# Altium schematic sheet Flash.SchDoc
size A4; SheetNumber: 8; SheetTotal: 8
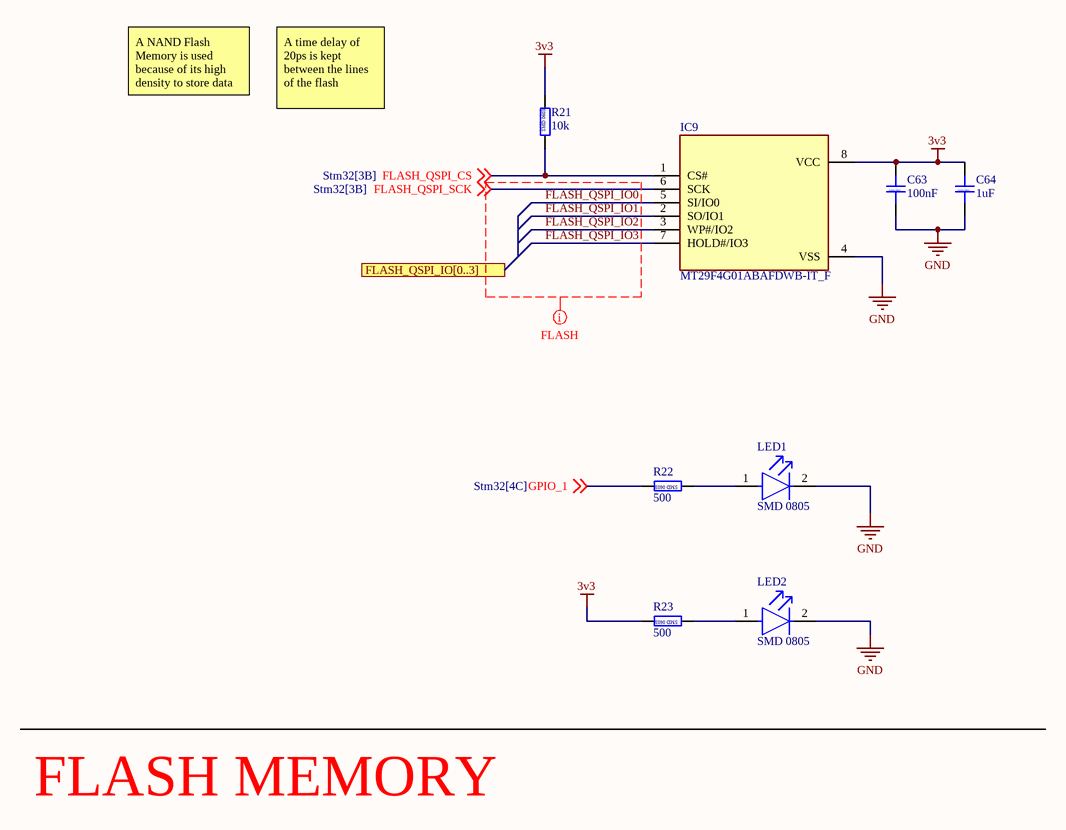
[diagram p0: Flash.SchDoc]

## Parts
C63  100nF  [CAP_0603]
C64  1uF  [CAP_0603]
IC9  MT29F4G01ABAFDWB-IT_F  [SON127P800X600X65-8N]
LED1  SMD 0805  [FP-SM0805YCL-MFG]
LED2  SMD 0805  [FP-SM0805YCL-MFG]
R21  10k  [RES_0603]
R22  500  [RES_0603]
R23  500  [RES_0603]

## Ports
FLASH_QSPI_IO[0..3]

## Nets
3v3: C63.2 C64.2 IC9.8(VCC) R21.2 R23.2
GND: C63.1 C64.1 IC9.4(VSS) LED1.2(C) LED2.2(C)
FLASH_QSPI_CS: IC9.1(CS#) R21.1 ; off-sheet FLASH_QSPI_CS
FLASH_QSPI_IO0: IC9.5(SI/IO0)
FLASH_QSPI_IO1: IC9.2(SO/IO1)
FLASH_QSPI_IO2: IC9.3(WP#/IO2)
FLASH_QSPI_IO3: IC9.7(HOLD#/IO3)
FLASH_QSPI_SCK: IC9.6(SCK) ; off-sheet FLASH_QSPI_SCK
GPIO_1: R22.2 ; off-sheet GPIO_1
NetLED1_1: LED1.1(A) R22.1
NetLED2_1: LED2.1(A) R23.1

## Layout directives
net class FLASH: FLASH_QSPI_IO0, FLASH_QSPI_IO1, FLASH_QSPI_IO2, FLASH_QSPI_IO3, FLASH_QSPI_SCK

## Notes on the sheet
- A NAND Flash Memory is used because of its high density to store data
- A time delay of 20ps is kept between the lines of the flash
- FLASH MEMORY
- (in symbol Capacitor-SMD-0603) SMD 0603
- (in symbol Resistor-SMD-0603) SMD 0603

## Library data of the parts
C63 C64 = Capacitor-SMD-0603: Capacitor SMD 0603 RATED
IC9 = MT29F4G01ABAFDWB-IT_F: Integrated Circuit; Manufacturer_Name: Micron; Manufacturer_Part_Number: MT29F4G01ABAFDWB-IT:F; Datasheet Link: https://www.farnell.com/datasheets/3151403.pdf; Height: 0.65mm; Mouser Part Number: 340-359563; Mouser Price/Stock: https://www.mouser.co.uk/ProductDetail/Micron/MT29F4G01ABAFDWB-ITF?qs=wUXugUrL1qwrjb7To7JPbA%3D%3D; Arrow Part Number: MT29F4G01ABAFDWB-IT:F; Arrow Price/Stock: null?region=nac
LED1 LED2 = CMP-35283-000007-1: LED YELLOW CLEAR 0805 SMD; Luminous Intensity: 11.5mcd; Test Current: 2mA; Viewing Angle: 130°; Dominant Wavelength: 592nm; Forward Voltage: 1.9V; Lens Color: Colorless; Case Code (Metric): 2012; Illumination Color: Yellow; Length: 2mm; Max Operating Temperature: 80°C; Width: 1.2mm; Case Code (Imperial): 0805; Packaging: Tape and Reel; Lens Transparency: Clear; Mount: Surface Mount; Case/Package: 0805; Forward Current: 2mA; Height: 0.8mm; Lead Free: Lead Free; Min Operating Temperature: -30°C; Color: Yellow; Package Quantity: 4000
R21-R23 = Resistor-SMD-0603: Resistor SMD 0603 RATED